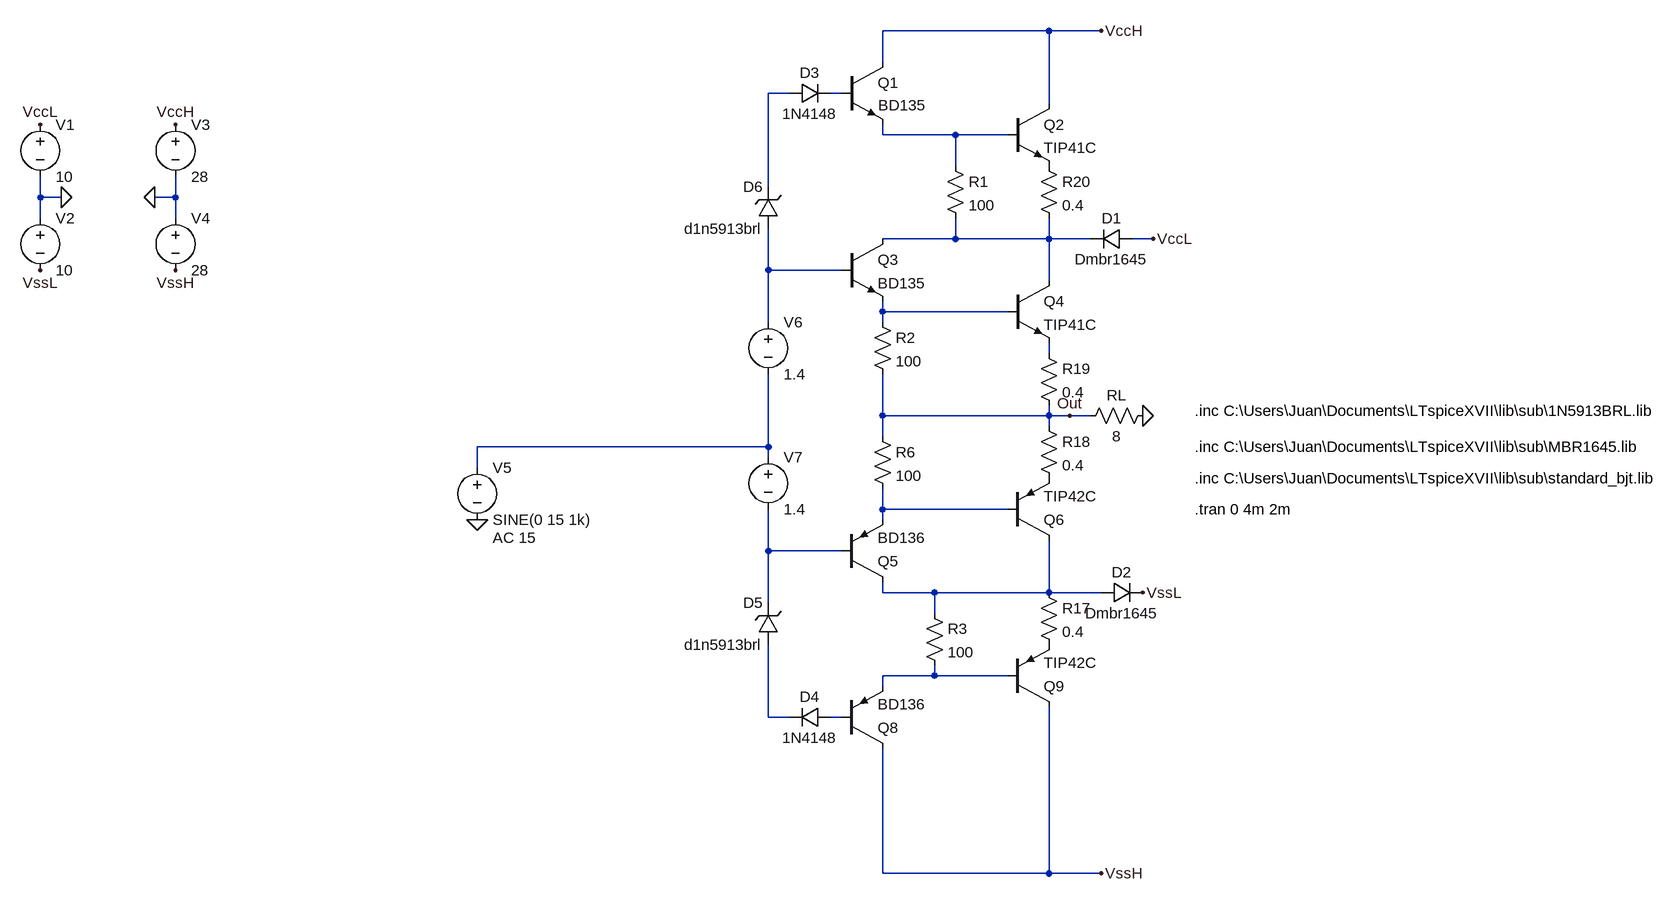
[diagram p0: schematic etapa_clase_G.asc]
etapa_clase_G.asc, the LTspice schematic file:
Version 4
SHEET 1 1736 1404
WIRE 432 48 176 48
WIRE 512 48 432 48
WIRE 176 96 176 48
WIRE 32 144 0 144
WIRE 112 144 96 144
WIRE 432 160 432 48
WIRE 176 208 176 192
WIRE 288 208 176 208
WIRE 368 208 288 208
WIRE 288 256 288 208
WIRE 0 288 0 144
WIRE -1120 304 -1120 272
WIRE -1088 304 -1120 304
WIRE -912 304 -912 272
WIRE -912 304 -944 304
WIRE -1120 336 -1120 304
WIRE -912 336 -912 304
WIRE 288 368 288 336
WIRE 288 368 176 368
WIRE 432 368 432 336
WIRE 432 368 288 368
WIRE 496 368 432 368
WIRE 592 368 560 368
WIRE 0 416 0 352
WIRE 112 416 0 416
WIRE 432 432 432 368
WIRE 176 480 176 464
WIRE 368 480 176 480
WIRE 0 496 0 416
WIRE 176 496 176 480
WIRE 432 544 432 528
WIRE 176 640 176 576
WIRE 432 640 432 624
WIRE 432 640 176 640
WIRE 464 640 432 640
WIRE 496 640 464 640
WIRE 432 656 432 640
WIRE 176 672 176 640
WIRE 0 688 0 576
WIRE 0 688 -448 688
WIRE 0 704 0 688
WIRE -448 720 -448 688
WIRE 176 784 176 752
WIRE 368 784 176 784
WIRE 176 800 176 784
WIRE 0 848 0 784
WIRE 112 848 0 848
WIRE 176 912 176 896
WIRE 256 912 176 912
WIRE 432 912 432 832
WIRE 432 912 256 912
WIRE 512 912 432 912
WIRE 0 928 0 848
WIRE 256 944 256 912
WIRE 256 1040 256 1024
WIRE 256 1040 176 1040
WIRE 368 1040 256 1040
WIRE 176 1056 176 1040
WIRE 0 1104 0 992
WIRE 32 1104 0 1104
WIRE 112 1104 96 1104
WIRE 176 1344 176 1152
WIRE 432 1344 432 1088
WIRE 432 1344 176 1344
WIRE 512 1344 432 1344
FLAG 592 368 VccL
FLAG 512 48 VccH
FLAG 576 640 0
FLAG 512 1344 VssH
FLAG 576 912 VssL
FLAG -1088 304 0
FLAG -944 304 0
FLAG -912 192 VccH
FLAG -1120 192 VccL
FLAG -912 416 VssH
FLAG -1120 416 VssL
FLAG 464 640 Out
FLAG -448 800 0
SYMBOL npn 112 96 R0
WINDOW 3 57 66 Left 2
SYMATTR Value BD135
SYMATTR InstName Q1
SYMBOL npn 368 160 R0
SYMATTR InstName Q2
SYMATTR Value TIP41C
SYMBOL npn 112 368 R0
SYMATTR InstName Q3
SYMATTR Value BD135
SYMBOL npn 368 432 R0
SYMATTR InstName Q4
SYMATTR Value TIP41C
SYMBOL res 272 240 R0
SYMATTR InstName R1
SYMATTR Value 100
SYMBOL diode 560 352 R90
WINDOW 0 0 32 VBottom 2
WINDOW 3 32 32 VTop 2
SYMATTR InstName D1
SYMATTR Value Dmbr1645
SYMBOL res 480 656 R270
WINDOW 0 32 56 VTop 2
WINDOW 3 0 56 VBottom 2
SYMATTR InstName RL
SYMATTR Value 8
SYMBOL pnp 112 896 M180
SYMATTR InstName Q5
SYMATTR Value BD136
SYMBOL pnp 368 832 M180
SYMATTR InstName Q6
SYMATTR Value TIP42C
SYMBOL diode 512 928 R270
WINDOW 0 32 32 VTop 2
WINDOW 3 0 32 VBottom 2
SYMATTR InstName D2
SYMATTR Value Dmbr1645
SYMBOL pnp 368 1088 M180
SYMATTR InstName Q9
SYMATTR Value TIP42C
SYMBOL pnp 112 1152 M180
SYMATTR InstName Q8
SYMATTR Value BD136
SYMBOL res 240 928 R0
SYMATTR InstName R3
SYMATTR Value 100
SYMBOL voltage -1120 176 R0
WINDOW 123 0 0 Left 0
WINDOW 39 0 0 Left 0
SYMATTR InstName V1
SYMATTR Value 10
SYMBOL voltage -1120 320 R0
WINDOW 123 0 0 Left 0
WINDOW 39 0 0 Left 0
SYMATTR InstName V2
SYMATTR Value 10
SYMBOL voltage -912 176 R0
WINDOW 123 0 0 Left 0
WINDOW 39 0 0 Left 0
SYMATTR InstName V3
SYMATTR Value 28
SYMBOL voltage -912 320 R0
WINDOW 123 0 0 Left 0
WINDOW 39 0 0 Left 0
SYMATTR InstName V4
SYMATTR Value 28
SYMBOL diode 32 160 R270
WINDOW 0 32 32 VTop 2
WINDOW 3 0 32 VBottom 2
SYMATTR InstName D3
SYMATTR Value 1N4148
SYMBOL diode 96 1088 R90
WINDOW 0 0 32 VBottom 2
WINDOW 3 32 32 VTop 2
SYMATTR InstName D4
SYMATTR Value 1N4148
SYMBOL res 160 480 R0
SYMATTR InstName R2
SYMATTR Value 100
SYMBOL res 160 656 R0
SYMATTR InstName R6
SYMATTR Value 100
SYMBOL zener 16 992 R180
WINDOW 0 24 64 Left 2
WINDOW 3 24 0 Left 2
SYMATTR InstName D5
SYMATTR Value d1n5913brl
SYMATTR Prefix X
SYMBOL zener 16 352 R180
WINDOW 0 24 64 Left 2
WINDOW 3 24 0 Left 2
SYMATTR InstName D6
SYMATTR Value d1n5913brl
SYMATTR Prefix X
SYMBOL voltage -448 704 R0
WINDOW 123 24 124 Left 2
WINDOW 39 0 0 Left 0
SYMATTR Value2 AC 15
SYMATTR InstName V5
SYMATTR Value SINE(0 15 1k)
SYMBOL res 416 896 R0
SYMATTR InstName R17
SYMATTR Value 0.4
SYMBOL res 416 640 R0
SYMATTR InstName R18
SYMATTR Value 0.4
SYMBOL res 416 528 R0
SYMATTR InstName R19
SYMATTR Value 0.4
SYMBOL res 416 240 R0
SYMATTR InstName R20
SYMATTR Value 0.4
SYMBOL voltage 0 480 R0
WINDOW 123 0 0 Left 0
WINDOW 39 0 0 Left 0
SYMATTR InstName V6
SYMATTR Value 1.4
SYMBOL voltage 0 688 R0
WINDOW 123 0 0 Left 0
WINDOW 39 0 0 Left 0
SYMATTR InstName V7
SYMATTR Value 1.4
TEXT 656 736 Left 2 !.inc C:\\Users\\Juan\\Documents\\LTspiceXVII\\lib\\sub\\standard_bjt.lib
TEXT 656 784 Left 2 !.tran 0 4m 2m
TEXT 656 688 Left 2 !.inc C:\\Users\\Juan\\Documents\\LTspiceXVII\\lib\\sub\\MBR1645.lib
TEXT 656 632 Left 2 !.inc C:\\Users\\Juan\\Documents\\LTspiceXVII\\lib\\sub\\1N5913BRL.lib

The netlist it stands for:
* etapa_clase_G.asc
Q1 VccH N002 N003 0 BD135
Q2 VccH N003 P001 0 TIP41C
Q3 N004 N005 N006 0 BD135
Q4 N004 N006 N007 0 TIP41C
R1 N003 N004 100
D1 VccL N004 Dmbr1645
RL Out 0 8
Q5 N011 N010 N009 0 BD136
Q6 N011 N009 P002 0 TIP42C
D2 N011 VssL Dmbr1645
Q9 VssH N012 P003 0 TIP42C
Q8 VssH N014 N012 0 BD136
R3 N011 N012 100
V1 VccL 0 10
V2 0 VssL 10
V3 VccH 0 28
V4 0 VssH 28
D3 N001 N002 1N4148
D4 N014 N013 1N4148
R2 N006 Out 100
R6 Out N009 100
XD5 N013 N010 d1n5913brl  ; pins + -
XD6 N005 N001 d1n5913brl  ; pins + -
V5 N008 0 SINE(0 15 1k) AC 15
R17 N011 P003 0.4
R18 Out P002 0.4
R19 N007 Out 0.4
R20 P001 N004 0.4
V6 N005 N008 1.4
V7 N008 N010 1.4
.model D D
.lib standard.dio
.model NPN NPN
.model PNP PNP
.lib standard.bjt
.inc C:\Users\Juan\Documents\LTspiceXVII\lib\sub\standard_bjt.lib
.tran 0 4m 2m
.inc C:\Users\Juan\Documents\LTspiceXVII\lib\sub\MBR1645.lib
.inc C:\Users\Juan\Documents\LTspiceXVII\lib\sub\1N5913BRL.lib
.backanno
.end